# Altium schematic sheet Audio Codec.SchDoc: Audio Codec
size Tabloid; ApprovedBy: NA; CompanyName: Cospan Design LLC; DrawnBy: David McCoy; Engineer: David McCoy; DocumentNumber: 13; Revision: A; SheetNumber: 13; SheetTotal: 18; Client: OSH; Project: Guppy Buddy; ProjectPrettyName: Guppy Buddy
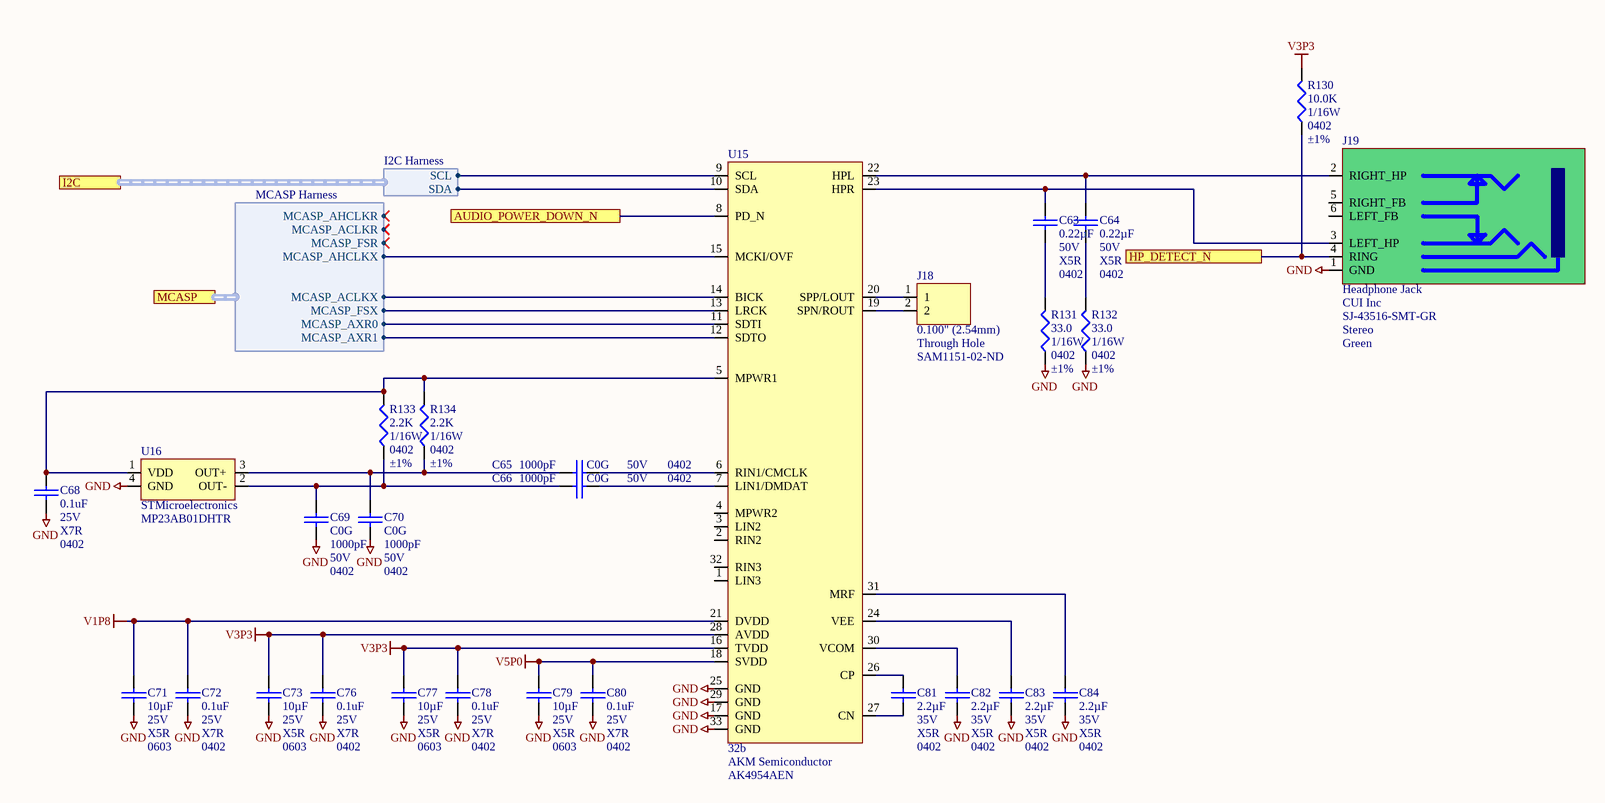
[diagram p0: Audio Codec.SchDoc]

## Parts
C63  Capacitance: 0.22µF  Voltage - Rated: 50V  Temperature Coefficient: X5R  Package / Case: 0402  [C_ERA-0402]  (hidden comment: C_0402_0.22UF_50V)
C64  Capacitance: 0.22µF  Voltage - Rated: 50V  Temperature Coefficient: X5R  Package / Case: 0402  [C_ERA-0402]  (hidden comment: C_0402_0.22UF_50V)
C65  Temperature Coefficient: C0G  Voltage - Rated: 50V  Package / Case: 0402  [C_ERA-0402]  (hidden comment: 1000pF)
C66  Temperature Coefficient: C0G  Voltage - Rated: 50V  Package / Case: 0402  [C_ERA-0402]  (hidden comment: 1000pF)
C68  Capacitance: 0.1uF  Voltage - Rated: 25V  Temperature Coefficient: X7R  Package / Case: 0402  [C_0402]  (hidden comment: C_0402_0.1UF_25V)
C69  Temperature Coefficient: C0G  Voltage - Rated: 50V  Package / Case: 0402  [C_ERA-0402]  (hidden comment: 1000pF)
C70  Temperature Coefficient: C0G  Voltage - Rated: 50V  Package / Case: 0402  [C_ERA-0402]  (hidden comment: 1000pF)
C71  Capacitance: 10µF  Voltage - Rated: 25V  Temperature Coefficient: X5R  Package / Case: 0603  [C_ERA-0603]  (hidden comment: C_0603_10µF)
C72  Capacitance: 0.1uF  Voltage - Rated: 25V  Temperature Coefficient: X7R  Package / Case: 0402  [C_0402]  (hidden comment: C_0402_0.1UF_25V)
C73  Capacitance: 10µF  Voltage - Rated: 25V  Temperature Coefficient: X5R  Package / Case: 0603  [C_ERA-0603]  (hidden comment: C_0603_10µF)
C76  Capacitance: 0.1uF  Voltage - Rated: 25V  Temperature Coefficient: X7R  Package / Case: 0402  [C_0402]  (hidden comment: C_0402_0.1UF_25V)
C77  Capacitance: 10µF  Voltage - Rated: 25V  Temperature Coefficient: X5R  Package / Case: 0603  [C_ERA-0603]  (hidden comment: C_0603_10µF)
C78  Capacitance: 0.1uF  Voltage - Rated: 25V  Temperature Coefficient: X7R  Package / Case: 0402  [C_0402]  (hidden comment: C_0402_0.1UF_25V)
C79  Capacitance: 10µF  Voltage - Rated: 25V  Temperature Coefficient: X5R  Package / Case: 0603  [C_ERA-0603]  (hidden comment: C_0603_10µF)
C80  Capacitance: 0.1uF  Voltage - Rated: 25V  Temperature Coefficient: X7R  Package / Case: 0402  [C_0402]  (hidden comment: C_0402_0.1UF_25V)
C81  Capacitance: 2.2µF  Voltage - Rated: 35V  Temperature Coefficient: X5R  Package / Case: 0402  [C_ERA-0402]  (hidden comment: C_0402_2.2uF_35V)
C82  Capacitance: 2.2µF  Voltage - Rated: 35V  Temperature Coefficient: X5R  Package / Case: 0402  [C_ERA-0402]  (hidden comment: C_0402_2.2uF_35V)
C83  Capacitance: 2.2µF  Voltage - Rated: 35V  Temperature Coefficient: X5R  Package / Case: 0402  [C_ERA-0402]  (hidden comment: C_0402_2.2uF_35V)
C84  Capacitance: 2.2µF  Voltage - Rated: 35V  Temperature Coefficient: X5R  Package / Case: 0402  [C_ERA-0402]  (hidden comment: C_0402_2.2uF_35V)
J18  Pitch: 0.100" (2.54mm)  Mounting Type: Through Hole  Supplier Part Number 1: SAM1151-02-ND  [1X2_HOLES_VERTICAL_FEMALE_HEADRER]  (hidden comment: J_HDR1X2_THRHOLE_VERT_FEMALE)
J19  Headphone Jack  Manufacturer: CUI Inc  Manufacturer Part Number: SJ-43516-SMT-GR  Signal Lines: Stereo  Color: Green  [HEADPHONE_JACK]
R130  Resistance In Ohms: 10.0K  Power (Watts): 1/16W  Case: 0402  Tolerance: ±1%  [R_0402]  (hidden comment: R_0402_10.0K)
R131  Resistance In Ohms: 33.0  Power (Watts): 1/16W  Case: 0402  Tolerance: ±1%  [R_0402]  (hidden comment: R_0402_33)
R132  Resistance In Ohms: 33.0  Power (Watts): 1/16W  Case: 0402  Tolerance: ±1%  [R_0402]  (hidden comment: R_0402_33)
R133  Resistance In Ohms: 2.2K  Power (Watts): 1/16W  Case: 0402  Tolerance: ±1%  [R_0402]  (hidden comment: R_0402_2.2K)
R134  Resistance In Ohms: 2.2K  Power (Watts): 1/16W  Case: 0402  Tolerance: ±1%  [R_0402]  (hidden comment: R_0402_2.2K)
U15  Resolution: 32b  Manufacturer 1: AKM Semiconductor  Manufacturer Part Number 1: AK4954AEN  [QFN40P400X400X80_HS-33N]  (hidden comment: U_AK4954AEN)
U16  Manufacturer 1: STMicroelectronics  Manufacturer Part Number 1: MP23AB01DHTR  [RHLGA]  (hidden comment: U_MP23AB01DHTR)

## Ports
AUDIO_POWER_DOWN_N, HP_DETECT_N, I2C (harness I2C Harness), MCASP (harness MCASP Harness)

## Harnesses
I2C Harness: SCL, SDA
MCASP Harness: MCASP_ACLKX, MCASP_FSX, MCASP_AXR0, MCASP_AHCLKR, MCASP_ACLKR, MCASP_FSR, MCASP_AXR1, MCASP_AHCLKX

## Nets
GND: C68.1 C69.2 C70.2 C71.1 C72.1 C73.1 C76.1 C77.1 C78.1 C79.1 C80.1 C82.1 C83.1 C84.1 J19.1(GND) R131.2 R132.2 U15.17(GND) U15.25(GND) U15.29(GND) U15.33(GND) U16.4(GND)
V1P8: C71.2 C72.2 U15.21(DVDD)
V3P3: C73.2 C76.2 C77.2 C78.2 R130.1 U15.16(TVDD) U15.28(AVDD)
V5P0: C79.2 C80.2 U15.18(SVDD)
AUDIO_POWER_DOWN_N: U15.8(PD_N) ; port AUDIO_POWER_DOWN_N
HP_DETECT_N: J19.4(RING) R130.2 ; port HP_DETECT_N
NetC63_1: C63.1 R131.1
NetC63_2: C63.2 J19.3(LEFT_HP) U15.23(HPR)
NetC64_1: C64.1 R132.1
NetC64_2: C64.2 J19.2(RIGHT_HP) U15.22(HPL)
NetC65_1: C65.1 U15.6(RIN1/CMCLK)
NetC65_2: C65.2 C70.1 R134.2 U16.3(OUT+)
NetC66_1: C66.1 U15.7(LIN1/DMDAT)
NetC66_2: C66.2 C69.1 R133.2 U16.2(OUT-)
NetC68_2: C68.2 R133.1 R134.1 U15.5(MPWR1) U16.1(VDD)
NetC81_1: C81.1 U15.27(CN)
NetC81_2: C81.2 U15.26(CP)
NetC82_2: C82.2 U15.30(VCOM)
NetC83_2: C83.2 U15.24(VEE)
NetC84_2: C84.2 U15.31(MRF)
NetJ18_1: J18.1 U15.20(SPP/LOUT)
NetJ18_2: J18.2 U15.19(SPN/ROUT)
NetU15_9: U15.9(SCL) ; port I2C.SCL
NetU15_10: U15.10(SDA) ; port I2C.SDA
NetU15_11: U15.11(SDTI) ; port MCASP.MCASP_AXR0
NetU15_12: U15.12(SDTO) ; port MCASP.MCASP_AXR1
NetU15_13: U15.13(LRCK) ; port MCASP.MCASP_FSX
NetU15_14: U15.14(BICK) ; port MCASP.MCASP_ACLKX
NetU15_15: U15.15(MCKI/OVF) ; port MCASP.MCASP_AHCLKX

Not connected (* = marked no-connect by the designer): J19 5(RIGHT_FB) 6(LEFT_FB); U15 1(LIN3) 2(RIN2) 3(LIN2) 4(MPWR2) 32(RIN3)

## Notes on the sheet
- Project:
- http://www.cospandesign.com
- Cospan Design
- Document:
- Engineer:
- Title:
- Client:
- Approved By:
- Revision:
- Date:
- Number:
- of

## Library data of the parts
C63 C64 = C_0402_0.22UF_50V: CAP CER 0.22UF 50V X5R 0402; Manufacturer: Taiyo Yuden; Manufacturer Part Number: UMK105BJ224KV-F; Tolerance: ±10%; Supplier 1: Digi-Key; RoHS: RoHS Compliant; Category: Capacitors; Stock 1: 141424; Pricing 1: 1=0.35, 10=0.263, 50=0.1532, 100=0.1225, 250=0.08752, 500=0.0595, 1000=0.04813, 5000=0.03763 (USD); Packaging: Digi-Reel®; Mounting Type: Surface Mount, MLCC; Operating Temperature: -55°C ~ 85°C; Applications: General Purpose; Ratings: -; Size / Dimension: 0.039" L x 0.020" W (1.00mm x 0.50mm); Height - Seated (Max): -; Thickness (Max): 0.022" (0.55mm); Lead Spacing: -; Features: -; Lead Style: -; ComponentLink1URL: http://ds.yuden.co.jp/TYCOMPAS/ut/detail.do?productNo=UMK105BJ224KV-F&fileName=UMK105BJ224KV-F_SS&mode=specSheetDownload; ComponentLink1Description: http://ds.yuden.co.jp/TYCOMPAS/ut/detail.do?productNo=UMK105BJ224KV-F&fileName=UMK105BJ224KV-F_SS&mode=specSheetDownload; Supplier Part Number 1: 587-3500-6-ND
C65 C66 C69 C70 = C_0402_1000PF_50V: CAP CER 1000PF 50V C0G 0402; Manufacturer: Murata Electronics North America; Manufacturer Part Number: GRM1555C1H102JA01D; Tolerance: ±5%; Supplier 1: Digi-Key; RoHS: RoHS Compliant; Category: Capacitors; Stock 1: 1327660; Pricing 1: 10=0.073, 100=0.0429, 500=0.02476, 1000=0.01716 (USD); Mounting Type: Surface Mount, MLCC; Operating Temperature: -55°C ~ 125°C; Features: -; Applications: General Purpose; Ratings: -; Size / Dimension: 0.040" L x 0.020" W (1.00mm x 0.50mm); Lead Spacing: -; Thickness: 0.50mm; Packaging: Cut Tape (CT); Lead Style: -; ComponentLink1URL: http://search.murata.co.jp/Ceramy/image/img/PDF/ENG/GRM1555C1H102JA01.pdf; ComponentLink1Description: http://search.murata.co.jp/Ceramy/image/img/PDF/ENG/GRM1555C1H102JA01.pdf; Supplier Part Number 1: 490-3244-1-ND; Capacitance: 1000pF
C68 C72 C76 C78 C80 = C_0402_0.1UF_25V: CAP CER 0.1UF 25V X6S 0402; Manufacturer 1: Yageo; Manufacturer Part Number 1: CC0402KRX7R8BB104; Description 1: Cap Ceramic 0.1uF 25V X7R 10% SMD 0402 125C Paper T/R; Tolerance: 10%; Dissipation Factor: 3.5%; ComponentLink1URL: https://product.tdk.com/info/en/catalog/datasheets/mlcc_commercial_general_en.pdf; ComponentLink1Description: https://product.tdk.com/info/en/catalog/datasheets/mlcc_commercial_general_en.pdf; Supplier 1: Digi-Key; Supplier Part Number 1: 311-2077-1-ND; Stock 1: 0; Pricing 1: 1=0.1, 10=0.048, 100=0.0215, 500=0.01534, 1000=0.01205, 2500=0.01095, 5000=0.01007 (USD); Mount: Surface Mount; Case/Package: 0402; Case Code (Imperial): 0402; Case Code (Metric): 1005; Min Operating Temperature: -55°C; Max Operating Temperature: 125°C; Voltage Rating: 25V; Voltage Rating (DC): 25V; Packaging: Tape and Reel; Dielectric: X7R; Termination: SMD/SMT; Composition: Ceramic; Length: 1mm; Height: 0.5mm; Width: 0.02inch; Thickness: 0.022inch; Depth: 0.5mm; Radiation Hardening: No; Lead Free: Lead Free; Halogen Free: Halogen Free; ComponentLink2URL: https://datasheet.ciiva.com/11464/upy-gphc-x7r-6-3v-to-50v-8-11464889.pdf; ComponentLink2Description: https://datasheet.ciiva.com/11464/upy-gphc-x7r-6-3v-to-50v-8-11464889.pdf; ComponentLink3URL: https://datasheet.ciiva.com/13210/upy-gphc-x7r-6-3v-to-50v-8-12304-13210908.pdf; ComponentLink3Description: https://datasheet.ciiva.com/13210/upy-gphc-x7r-6-3v-to-50v-8-12304-13210908.pdf; ComponentLink4URL: https://datasheet.ciiva.com/17437/upy-gphc-x7r-6-3v-to-50v-8-17437357.pdf; ComponentLink4Description: https://datasheet.ciiva.com/17437/upy-gphc-x7r-6-3v-to-50v-8-17437357.pdf
C71 C73 C77 C79 = C_0603_10µF: CAP CER 10UF 16V X5R 0603; Manufacturer: Murata Electronics North America; Manufacturer Part Number: GRM188R61C106MA73D; Tolerance: ±20%; Supplier 1: Digi-Key; RoHS: RoHS Compliant; Category: Capacitors; Stock 1: 450536; Pricing 1: 1=0.35, 10=0.303, 50=0.184, 100=0.1516, 250=0.12124, 500=0.11042, 1000=0.09959 (USD); Packaging: Cut Tape (CT); Mounting Type: Surface Mount, MLCC; Operating Temperature: -55°C ~ 85°C; Applications: General Purpose; Ratings: -; Size / Dimension: 0.063" L x 0.031" W (1.60mm x 0.80mm); Height - Seated (Max): -; Thickness (Max): 0.031" (0.80mm); Lead Spacing: -; Features: -; Lead Style: -; ComponentLink1URL: http://www.murata.com/~/media/webrenewal/support/library/catalog/products/capacitor/mlcc/c02e.pdf; ComponentLink1Description: http://www.murata.com/~/media/webrenewal/support/library/catalog/products/capacitor/mlcc/c02e.pdf; Supplier Part Number 1: 490-7201-1-ND
C81-C84 = C_0402_2.2uF_35V: CAP CER 2.2UF 35V 20% X5R 0402; Manufacturer: TDK Corporation; Manufacturer Part Number: C1005X5R1V225K050BC; Tolerance: ±10%; Supplier 1: Digi-Key; RoHS: RoHS Compliant; Category: Capacitors; Stock 1: 300469; Pricing 1: 1=0.36, 10=0.253, 100=0.1518, 500=0.11386, 1000=0.09614, 2500=0.09108, 5000=0.08602 (USD); Packaging: Cut Tape (CT); Part Status: Active; Operating Temperature: -55°C ~ 85°C; Features: Low ESL; Ratings: -; Applications: General Purpose; Failure Rate: -; Mounting Type: Surface Mount, MLCC; Size / Dimension: 0.039" L x 0.020" W (1.00mm x 0.50mm); Height - Seated (Max): -; Thickness (Max): 0.022" (0.55mm); Lead Spacing: -; Lead Style: -; ComponentLink1URL: https://product.tdk.com/info/en/catalog/datasheets/mlcc_commercial_general_en.pdf; ComponentLink1Description: https://product.tdk.com/info/en/catalog/datasheets/mlcc_commercial_general_en.pdf; Supplier Part Number 1: 445-9028-1-ND
J18 = J_HDR1X2_THRHOLE_VERT_FEMALE: CONN RCPT .100" 2POS SNGL HORZ; Manufacturer: Samtec Inc; Manufacturer Part Number: SSM-102-S-SH; Connector Type: Receptacle; Number of Positions: 2; Number of Positions Loaded: All; Supplier 1: Digi-Key; RoHS: RoHS Compliant; Category: Connectors, Interconnects; Stock 1: 0; Pricing 1: 1=0 (USD); Packaging: Tube; Contact Type: Female Socket; Number of Rows: 1; Row Spacing: -; Termination: Solder; Fastening Type: -; Features: -; Contact Finish: Gold; Contact Finish Thickness: 30µin (0.76µm); Color: Black; ComponentLink1URL: http://www.samtec.com/ftppub/cpdf/SSM-1XX-XXX-XX-XX-XX-X-XX-XX-MKT.pdf; ComponentLink1Description: http://www.samtec.com/ftppub/cpdf/SSM-1XX-XXX-XX-XX-XX-X-XX-XX-MKT.pdf
J19 = J_HEADPHONE_JACK: CONN AUDIO JACK 3.5MM 4COND SMD; Gender: Female; Plug/Mating Plug Diameter: 3.50mm (0.141", 1/8", Mini Plug) - Headphone; Number of Positions/Contacts: 4 Conductors, 6 Contacts; Internal Switch(s): Two Switches; Shielding: Unshielded; Supplier 1: Digi-Key; Supplier Part Number 1: CP-43516SJGRCT-ND; RoHS: RoHS Compliant; Category: Connectors, Interconnects; Stock 1: 3934; Pricing: 1=1.26, 10=0.982, 100=0.749, 500=0.59796 (USD); Connector Type: Phone Jack; Mounting Type: Surface Mount, Right Angle; Termination: Solder; Features: Board Guide; Packaging: Cut Tape (CT); ComponentLink1URL: http://products.cui.com/GetSpecForDigikey.aspx?MFGNum=SJ-43516-SMT; ComponentLink1Description: http://products.cui.com/GetSpecForDigikey.aspx?MFGNum=SJ-43516-SMT
R130 = R_0402_10.0K: RES 10.0K OHM 1/16W 1% 0402 SMD; Manufacturer: Stackpole Electronics Inc; Manufacturer Part Number: RMCF0402FT10K0; Resistance (Ohms): 10k; Temperature Coefficient: ±100ppm/°C; Supplier 1: Digi-Key; Supplier Part Number 1: RMCF0402FT10K0CT-ND; RoHS: RoHS Compliant; Category: Resistors; Stock 1: 234525; Pricing: 1=0.04, 10=0.025, 50=0.0138, 100=0.0105, 250=0.0078, 500=0.00576, 1000=0.00384, 2500=0.00324, 5000=0.0027 (USD); Composition: Thick Film; Features: -; Package / Case: 0402 (1005 Metric); Size / Dimension: 0.039" L x 0.020" W (1.00mm x 0.50mm); Height: 0.016" (0.40mm); Number of Terminations: 2; Packaging: Cut Tape (CT); ComponentLink1URL: http://www.seielect.com/Catalog/SEI-RMCF_RMCP.pdf; ComponentLink1Description: http://www.seielect.com/Catalog/SEI-RMCF_RMCP.pdf
R131 R132 = R_0402_33: RES 33.0 OHM 1/16W 1% 0402 SMD; Manufacturer: Yageo; Manufacturer Part Number: RC0402FR-0733RL; Resistance (Ohms): 33; Temperature Coefficient: ±100ppm/°C; Supplier 1: Digi-Key; Supplier Part Number 1: 311-33.0LRCT-ND; RoHS: RoHS Compliant; Category: Resistors; Stock 1: 733920; Pricing: 10=0.014, 50=0.0104, 100=0.0079, 250=0.00584, 500=0.00432, 1000=0.00288 (USD); Composition: Thick Film; Features: -; Size / Dimension: 0.039" L x 0.020" W (1.00mm x 0.50mm); Height: 0.014" (0.35mm); Number of Terminations: 2; Packaging: Cut Tape (CT); Package / Case: 0402 (1005 Metric); ComponentLink1URL: http://www.yageo.com/documents/recent/PYu-RC0402_51_RoHS_L_6.pdf; ComponentLink1Description: http://www.yageo.com/documents/recent/PYu-RC0402_51_RoHS_L_6.pdf
R133 R134 = R_0402_2.2K: RES SMD 2.2K OHM 1% 1/10W 0402; Manufacturer: Panasonic Electronic Components; Manufacturer Part Number: ERJ-2RKF2201X; Temperature Coefficient: ±100ppm/°C; Supplier 1: Digi-Key; RoHS: RoHS Compliant; Category: Resistors; Stock 1: 1256647; Pricing 1: 1=0.1, 50=0.015, 100=0.011, 250=0.0084, 500=0.00674, 1000=0.00496, 5000=0.00355 (USD); Packaging: Cut Tape (CT); Resistance (Ohms): 2.2k; Composition: Thick Film; Features: Automotive AEC-Q200; Operating Temperature: -55°C ~ 155°C; Package / Case: 0402 (1005 Metric); Supplier Device Package: 0402; Size / Dimension: 0.039" L x 0.020" W (1.00mm x 0.50mm); Height: 0.016" (0.40mm); Number of Terminations: 2; ComponentLink1URL: http://industrial.panasonic.com/www-cgi/jvcr13pz.cgi?E+PZ+3+AOA0002+ERJ2RKF2201X+7+WW; ComponentLink1Description: http://industrial.panasonic.com/www-cgi/jvcr13pz.cgi?E+PZ+3+AOA0002+ERJ2RKF2201X+7+WW; Supplier Part Number 1: P2.20KLCT-ND
U15 = U_AK4954AEN: IC STEREO CODEC 32BIT 32QFN; Interface: Serial; Supplier 1: Digi-Key; Supplier Part Number 1: 974-1065-1-ND; Description 1: IC STEREO CODEC 32BIT 32QFN; Stock 1: 0; Mount: Surface Mount; Min Operating Temperature: -30°C; Max Operating Temperature: 85°C; Packaging: Tape and Reel; ComponentLink1URL: http://www.akm.com/akm/en/file/datasheet/AK4954AEN.pdf; ComponentLink1Description: http://www.akm.com/akm/en/file/datasheet/AK4954AEN.pdf
U16 = U_MP23AB01DHTR: MIC MEMS ANALOG OMNI -38DB; Supplier 1: Digi-Key; Supplier Part Number 1: 497-17051-6-ND; Stock 1: 5150; Pricing 1: 1=1.59, 10=1.257, 100=1.0017, 500=0.84854, 1000=0.7975 (USD); ComponentLink1URL: http://www.farnell.com/datasheets/2310300.pdf; ComponentLink1Description: http://www.farnell.com/datasheets/2310300.pdf